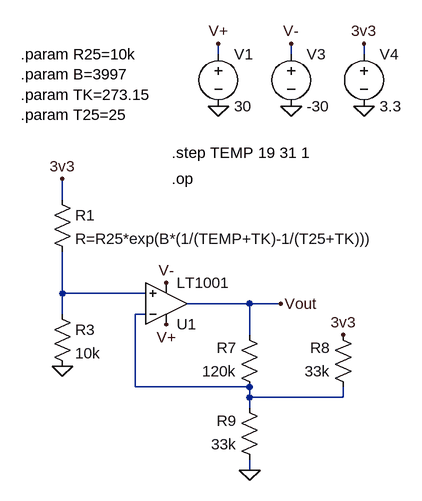
[diagram p0: schematic Thermistor-3.3v-20C-30C.asc]
Thermistor-3.3v-20C-30C.asc, the LTspice schematic file:
Version 4
SHEET 1 1456 884
WIRE 160 -112 160 -128
WIRE 272 -112 272 -128
WIRE 384 -112 384 -128
WIRE -80 112 -80 80
WIRE -80 256 -80 192
WIRE 48 256 -80 256
WIRE 208 272 112 272
WIRE 256 272 208 272
WIRE -80 288 -80 256
WIRE 48 288 32 288
WIRE 208 320 208 272
WIRE 32 400 32 288
WIRE 208 400 32 400
WIRE 208 416 208 400
WIRE 352 416 352 400
WIRE 352 416 208 416
WIRE 208 432 208 416
WIRE 208 528 208 512
FLAG -80 368 0
FLAG 160 -32 0
FLAG 272 -32 0
FLAG 160 -128 V+
FLAG 272 -128 V-
FLAG 80 240 V-
FLAG 80 304 V+
FLAG 352 320 3v3
FLAG 384 -32 0
FLAG 384 -128 3v3
FLAG 208 528 0
FLAG -80 80 3v3
FLAG 256 272 Vout
SYMBOL res -96 96 R0
SYMATTR InstName R1
SYMATTR Value R=R25*exp(B*(1/(TEMP+TK)-1/(T25+TK)))
SYMBOL res -96 272 R0
SYMATTR InstName R3
SYMATTR Value 10k
SYMBOL Opamps\\LT1001 80 336 M180
SYMATTR InstName U1
SYMBOL voltage 160 -128 R0
WINDOW 123 0 0 Left 2
WINDOW 39 0 0 Left 2
SYMATTR InstName V1
SYMATTR Value 30
SYMBOL voltage 272 -128 R0
WINDOW 123 0 0 Left 2
WINDOW 39 0 0 Left 2
SYMATTR InstName V3
SYMATTR Value -30
SYMBOL res 224 416 R180
WINDOW 0 36 76 Left 2
WINDOW 3 36 40 Left 2
SYMATTR InstName R7
SYMATTR Value 120k
SYMBOL res 368 416 R180
WINDOW 0 36 76 Left 2
WINDOW 3 36 40 Left 2
SYMATTR InstName R8
SYMATTR Value 33k
SYMBOL res 224 528 R180
WINDOW 0 36 76 Left 2
WINDOW 3 36 40 Left 2
SYMATTR InstName R9
SYMATTR Value 33k
SYMBOL voltage 384 -128 R0
WINDOW 123 0 0 Left 2
WINDOW 39 0 0 Left 2
SYMATTR InstName V4
SYMATTR Value 3.3
TEXT -144 -112 Left 2 !.param R25=10k\n.param B=3997\n.param TK=273.15\n.param T25=25
TEXT 88 40 Left 2 !.step TEMP 19 31 1
TEXT 88 80 Left 2 !.op

The netlist it stands for:
* Thermistor-3.3v-20C-30C.asc
R1 3v3 N001 R=R25*exp(B*(1/(TEMP+TK)-1/(T25+TK)))
R3 N001 0 10k
XU1 N001 N002 V+ V- Vout LT1001  ; pins In+ In- V+ V- OUT
V1 V+ 0 30
V3 V- 0 -30
R7 N002 Vout 120k
R8 N002 3v3 33k
R9 0 N002 33k
V4 3v3 0 3.3
.param R25=10k
.param B=3997
.param TK=273.15
.param T25=25
.step TEMP 19 31 1
.op
.lib LTC.lib
.backanno
.end